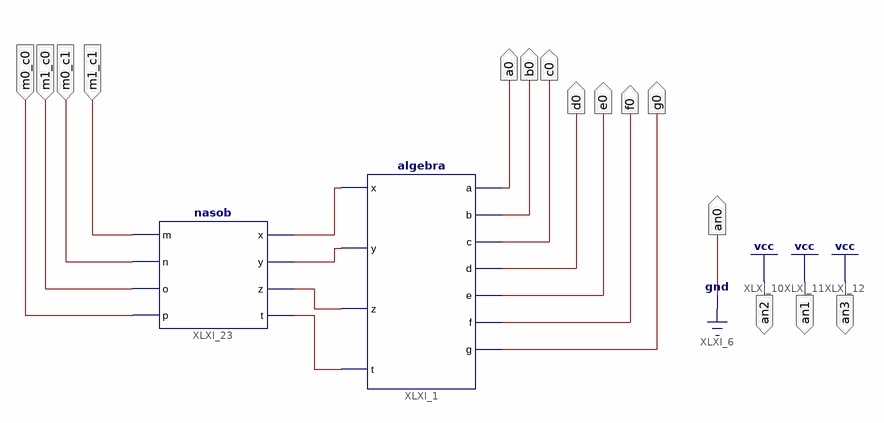
[diagram p0: schematic sheet 1]
// Xilinx ISE schematic schema.sch (spartan3e) as structural Verilog: 2 symbols, 15 ports
module schema (
  input  m1_c1,
  input  m0_c1,
  input  m1_c0,
  input  m0_c0,
  output a0,
  output b0,
  output c0,
  output f0,
  output d0,
  output g0,
  output e0,
  output an2,
  output an1,
  output an3,
  output an0
);

  wire XLXN_38, XLXN_39, XLXN_53, XLXN_55;

  algebra XLXI_1 (
    .x(XLXN_39), .y(XLXN_38), .z(XLXN_53), .t(XLXN_55), .a(a0), .b(b0), .c(c0), .d(d0), .e(e0), .f(f0), .g(g0));
  nasob XLXI_23 (.m(m1_c1), .n(m0_c1), .o(m1_c0), .p(m0_c0), .x(XLXN_39), .y(XLXN_38), .z(XLXN_53), .t(XLXN_55));

  assign an0 = 1'b0;
  assign an1 = 1'b1;
  assign an2 = 1'b1;
  assign an3 = 1'b1;
endmodule
